# Altium schematic sheet S3220A1.SchDoc: Power supply and interfaces
size A3; Revision: A; SheetNumber: 1; SheetTotal: 5
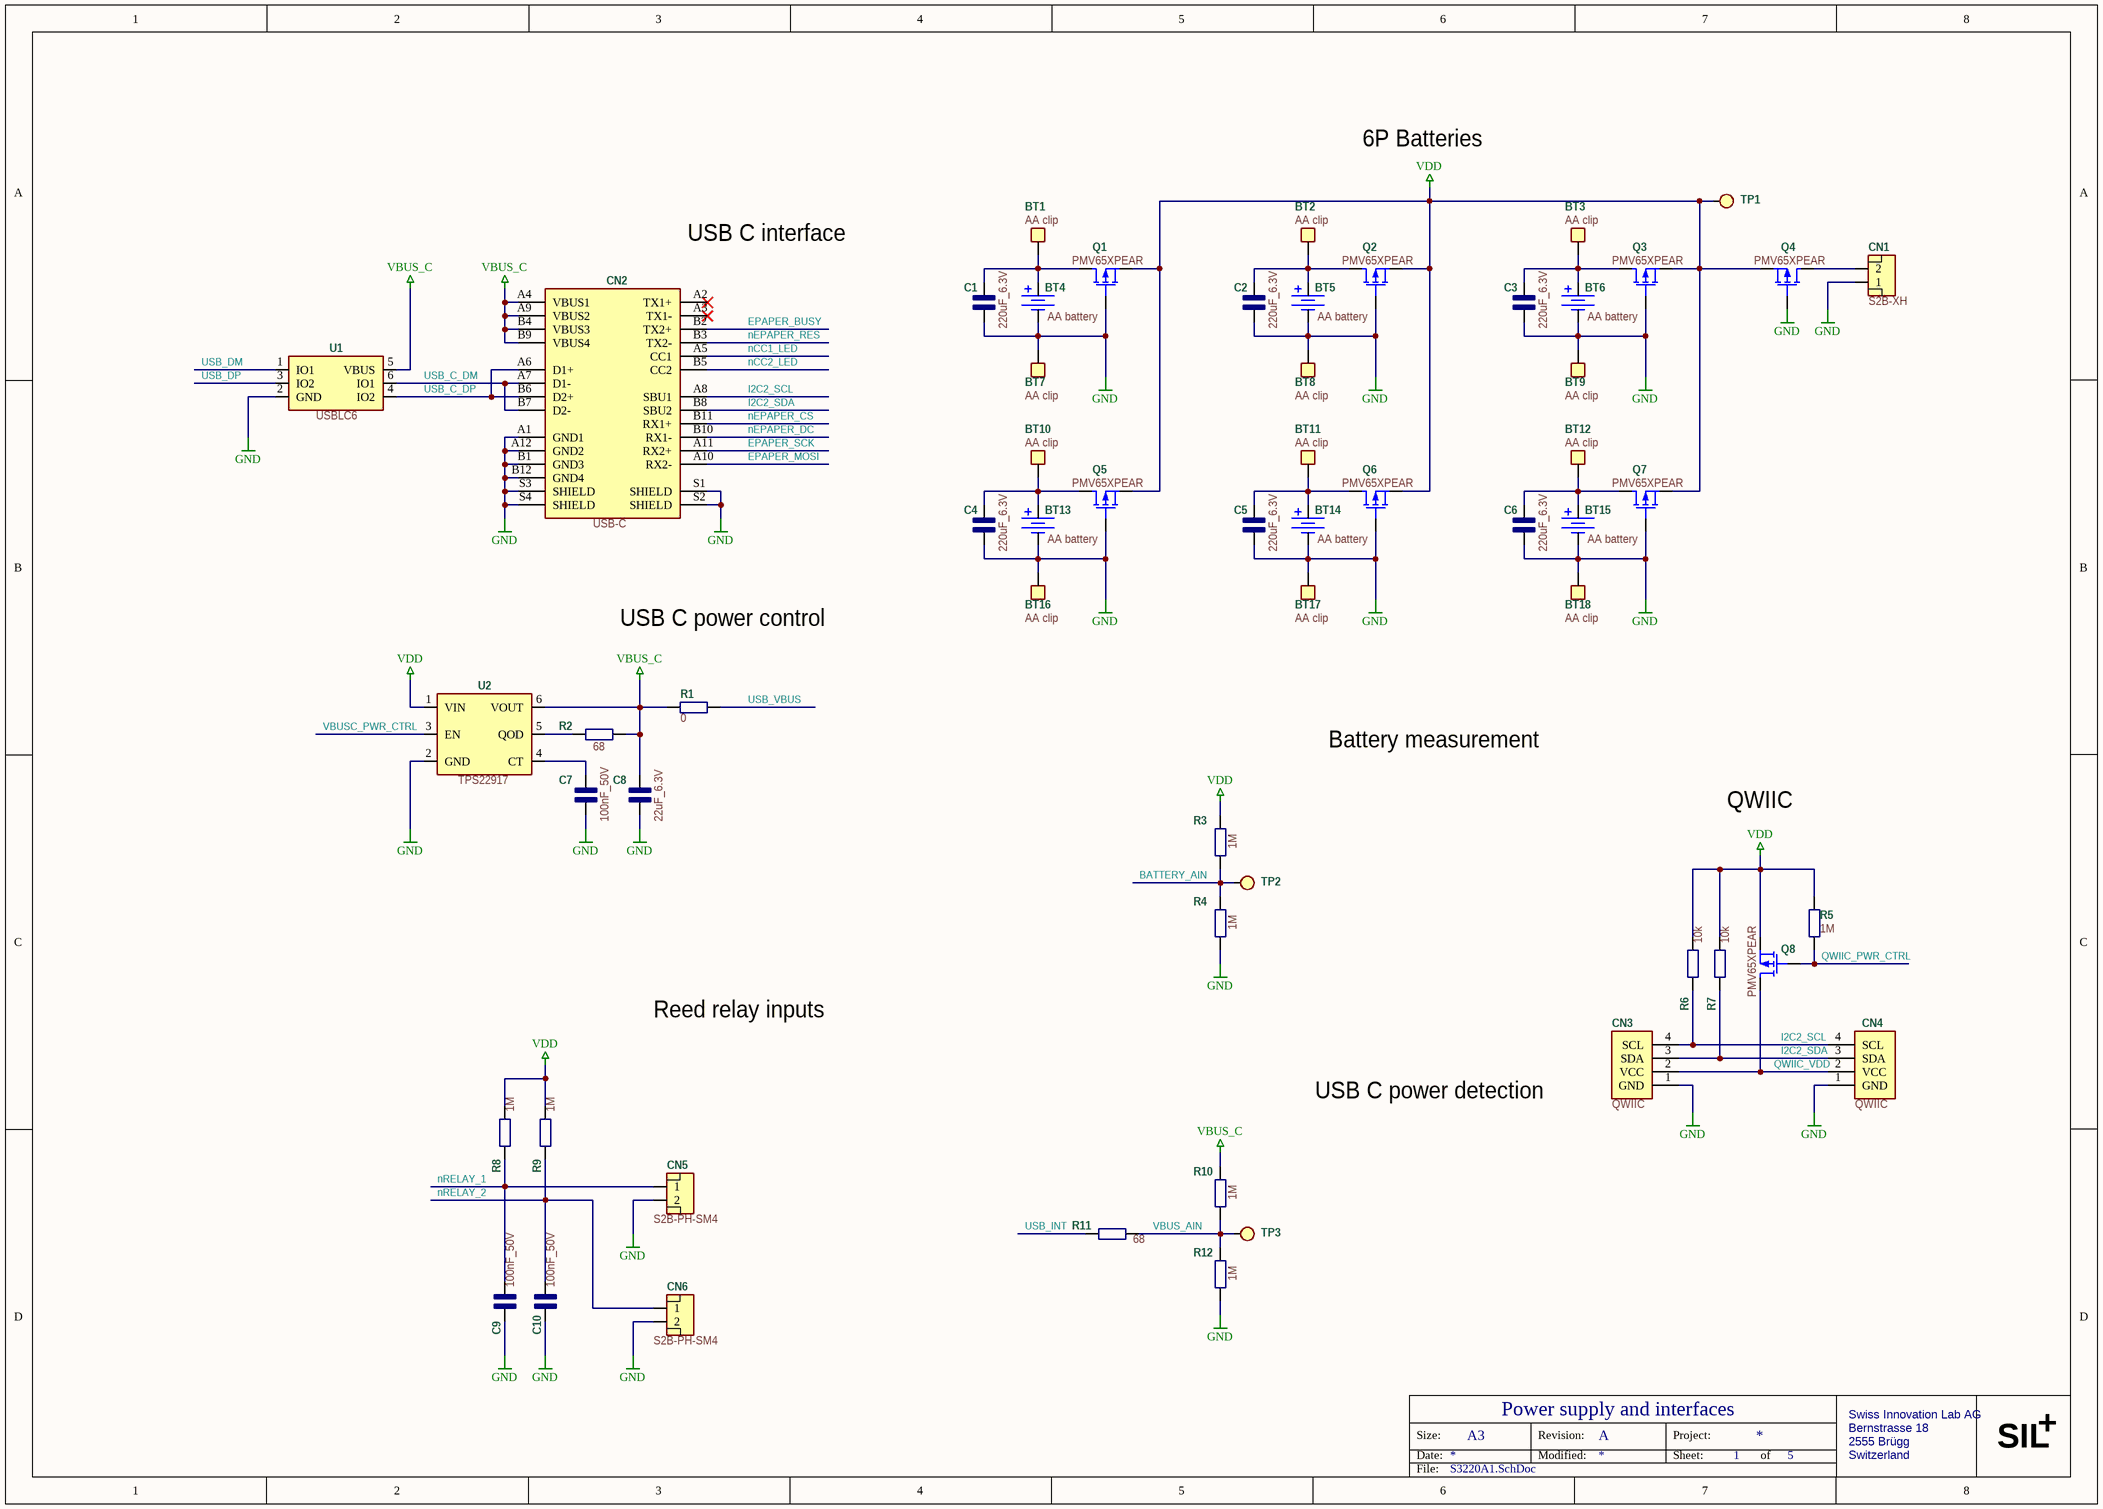
[diagram p0: S3220A1.SchDoc]

## Parts
BT1  AA clip  [BT_AA-TH-CLIP]  (no BOM)
BT2  AA clip  [BT_AA-TH-CLIP]  (no BOM)
BT3  AA clip  [BT_AA-TH-CLIP]  (no BOM)
BT4  AA battery  [BT_AA-battery]  (no BOM)
BT5  AA battery  [BT_AA-battery]  (no BOM)
BT6  AA battery  [BT_AA-battery]  (no BOM)
BT7  AA clip  [BT_AA-TH-CLIP]  (no BOM)
BT8  AA clip  [BT_AA-TH-CLIP]  (no BOM)
BT9  AA clip  [BT_AA-TH-CLIP]  (no BOM)
BT10  AA clip  [BT_AA-TH-CLIP]  (no BOM)
BT11  AA clip  [BT_AA-TH-CLIP]  (no BOM)
BT12  AA clip  [BT_AA-TH-CLIP]  (no BOM)
BT13  AA battery  [BT_AA-battery]  (no BOM)
BT14  AA battery  [BT_AA-battery]  (no BOM)
BT15  AA battery  [BT_AA-battery]  (no BOM)
BT16  AA clip  [BT_AA-TH-CLIP]  (no BOM)
BT17  AA clip  [BT_AA-TH-CLIP]  (no BOM)
BT18  AA clip  [BT_AA-TH-CLIP]  (no BOM)
C1  220uF_6.3V  [C_1206]
C2  220uF_6.3V  [C_1206]
C3  220uF_6.3V  [C_1206]
C4  220uF_6.3V  [C_1206]
C5  220uF_6.3V  [C_1206]
C6  220uF_6.3V  [C_1206]
C7  100nF_50V  [C_0603]
C8  22uF_6.3V  [C_0603]
C9  100nF_50V  [C_0603]
C10  100nF_50V  [C_0603]
CN1  S2B-XH  [CN_S2B-XH-A]
CN2  USB-C  [CN_USB-C-RA_2]
CN3  QWIIC  [CN_SM04B-SRSS-TB]
CN4  QWIIC  [CN_SM04B-SRSS-TB]
CN5  S2B-PH-SM4  [CN_S2B-PH-SM4]
CN6  S2B-PH-SM4  [CN_S2B-PH-SM4]
Q1  PMV65XPEAR  [U_SOT23-3]
Q2  PMV65XPEAR  [U_SOT23-3]
Q3  PMV65XPEAR  [U_SOT23-3]
Q4  PMV65XPEAR  [U_SOT23-3]
Q5  PMV65XPEAR  [U_SOT23-3]
Q6  PMV65XPEAR  [U_SOT23-3]
Q7  PMV65XPEAR  [U_SOT23-3]
Q8  PMV65XPEAR  [U_SOT23-3]
R1  0  [R_0603]
R2  68  [R_0603]
R3  1M  [R_0603]
R4  1M  [R_0603]
R5  1M  [R_0603]
R6  10k  [R_0603]
R7  10k  [R_0603]
R8  1M  [R_0603]
R9  1M  [R_0603]
R10  1M  [R_0603]
R11  68  [R_0603]
R12  1M  [R_0603]
TP1  Test point  [TP_SMD_R1.0mm]  (value not drawn)  (no BOM)
TP2  Test point  [TP_SMD_R1.0mm]  (value not drawn)  (no BOM)
TP3  Test point  [TP_SMD_R1.0mm]  (value not drawn)  (no BOM)
U1  USBLC6  [U_SOT23-6]
U2  TPS22917  [U_SOT23-6]

## Nets
GND: BT7.1 BT8.1 BT9.1 BT16.1 BT17.1 BT18.1 C1.1 C2.1 C3.1 C4.1 C5.1 C6.1 C7.1 C8.1 C9.1 C10.1 CN1.1 CN2.A1(GND1) CN2.A12(GND2) CN2.B1(GND3) CN2.B12(GND4) CN2.S1(SHIELD) CN2.S2(SHIELD) CN2.S3(SHIELD) CN2.S4(SHIELD) CN3.1(GND) CN4.1(GND) CN5.2 CN6.2 Q1.1(G) Q2.1(G) Q3.1(G) Q4.1(G) Q5.1(G) Q6.1(G) Q7.1(G) R4.1 R12.1 U1.2(GND) U2.2(GND)
VBUS_C: C8.2 CN2.A4(VBUS1) CN2.A9(VBUS2) CN2.B4(VBUS3) CN2.B9(VBUS4) R1.1 R2.1 R10.2 U1.5(VBUS) U2.6(VOUT)
VDD: Q1.2(S) Q2.2(S) Q3.2(S) Q4.2(S) Q5.2(S) Q6.2(S) Q7.2(S) Q8.2(S) R3.2 R5.2 R6.2 R7.2 R8.2 R9.2 TP1.1 U2.1(VIN)
BATTERY_AIN: R3.1 R4.2 TP2.1
EPAPER_BUSY: CN2.B2(TX2+)
EPAPER_MOSI: CN2.A10(RX2-)
EPAPER_SCK: CN2.A11(RX2+)
I2C2_SCL: CN2.A8(SBU1) CN3.4(SCL) CN4.4(SCL) R6.1
I2C2_SDA: CN2.B8(SBU2) CN3.3(SDA) CN4.3(SDA) R7.1
nCC1_LED: CN2.A5(CC1)
nCC2_LED: CN2.B5(CC2)
nEPAPER_CS: CN2.B11(RX1+)
nEPAPER_DC: CN2.B10(RX1-)
nEPAPER_RES: CN2.B3(TX2-)
nRELAY_1: C9.2 CN5.1 R8.1
nRELAY_2: C10.2 CN6.1 R9.1
QWIIC_PWR_CTRL: Q8.1(G) R5.1
QWIIC_VDD: CN3.2(VCC) CN4.2(VCC) Q8.3(D)
USB_C_DM: CN2.A7(D1-) CN2.B7(D2-) U1.6(IO1)
USB_C_DP: CN2.A6(D1+) CN2.B6(D2+) U1.4(IO2)
USB_DM: U1.1(IO1)
USB_DP: U1.3(IO2)
USB_INT: R11.1
USB_VBUS: R1.2
VBUS_AIN: R10.1 R11.2 R12.2 TP3.1
VBUSC_PWR_CTRL: U2.3(EN)
NetBT1_1: BT1.1 C1.2 Q1.3(D)
NetBT2_1: BT2.1 C2.2 Q2.3(D)
NetBT3_1: BT3.1 C3.2 Q3.3(D)
NetBT10_1: BT10.1 C4.2 Q5.3(D)
NetBT11_1: BT11.1 C5.2 Q6.3(D)
NetBT12_1: BT12.1 C6.2 Q7.3(D)
NetC7_2: C7.2 U2.4(CT)
NetCN1_2: CN1.2 Q4.3(D)
NetR2_2: R2.2 U2.5(QOD)

Not connected (* = marked no-connect by the designer): CN2 A2(TX1+)* A3(TX1-)*

## Notes on the sheet
- 6P Batteries
- USB C interface
- USB C power control
- Battery measurement
- QWIIC
- Reed relay inputs
- USB C power detection
- Size:
- Date:
- A3
- Revision:
- Modified:
- Project:
- Sheet:
- of
- Swiss Innovation Lab AG
- Bernstrasse 18
- 2555 Brügg
- Switzerland
- SIL
- +
- File:

## Library data of the parts
BT1-BT3 BT7-BT12 BT16-BT18 = BT_AA-TH-CLIP: Battery Contact Clip A, AA 1 Cell PC Pin; Manufacturer: Keystone Electronics; Manufacturer Part Number: 92; Currency: $; Value: AA clip; Price: 0,20178; Supplier 1: Digi-Key; Supplier Part Number 1: 36-92-ND
BT4-BT6 BT13-BT15 = BT_AA-battery: Manufacturer: SIL; Currency: $; Value: AA battery; Supplier 1: SIL
C1-C6 = C_220uF_6.3V: 220µF ±20% 6.3V Ceramic Capacitor X5R 1206 (3216 Metric); Manufacturer: Murata Electronics North America; Manufacturer Part Number: GRM31CR60J227ME11L; Value: 220uF; ValueAux: _6.3V; Currency: $; Price: 0,59945; Supplier 1: Digi-Key; Supplier Part Number 1: 490-13970-1-ND
C7 C9 C10 = C_100nF_50V: 0.1µF ±10% 50V Ceramic Capacitor X7R 0603 (1608 Metric); Manufacturer: TDK; Manufacturer Part Number: C1608X7R1H104K080AA; Value: 100nF; ValueAux: _50V; Currency: $; Price: 0,01309; Supplier 1: Digi-Key; Supplier Part Number 1: 445-1314-6-ND
C8 = C_22uF_6V3: 22µF ±20% 6.3V Ceramic Capacitor X5R 0603 (1608 Metric); Manufacturer: Samsung Electro-Mechanics; Manufacturer Part Number: CL10A226MQ8NRNC; Value: 22uF; ValueAux: _6.3V; Currency: $; Price: 0,04566; Supplier 1: Digi-Key; Supplier Part Number 1: 1276-1193-1-ND
CN1 = CN_S2B-XH: Connector Header Through Hole, Right Angle 2 position 0.098" (2.50mm); Manufacturer: JST Sales America Inc.; Manufacturer Part Number: S2B-XH-A(LF)(SN); Currency: $; Supplier 1: Digi-Key; Supplier Part Number 1: 455-2257-ND; Value: S2B-XH; Price: 0,07792
CN2 = CN_USB-C-RA_2: USB-C (USB TYPE-C) USB 3.2 Gen 2 (USB 3.1 Gen 2, Superspeed + (USB 3.1)) Receptacle Connector 24 Position Surface Mount, Right Angle; Through Hole; Manufacturer: CUI Devices; Manufacturer Part Number: UJ31-CH-G-SMT-TR-67; Currency: $; Value: USB-C; Price: 2,43252; Supplier 1: Digi-Key; Supplier Part Number 1: 2223-UJ31-CH-G-SMT-TR-67CT-ND
CN3 CN4 = CN_QWICC: Connector Header Surface Mount, Right Angle 4 position 0.039" (1.00mm); Manufacturer: JST Sales America Inc.; Manufacturer Part Number: SM04B-SRSS-TB(LF)(SN); Currency: $; Supplier 1: Digi-Key; Supplier Part Number 1: 455-1804-1-ND; Value: QWIIC; Price: 0,61
CN5 CN6 = CN_S2B-PH-SM4: Connector Header Surface Mount, Right Angle 2 position 0.079" (2.00mm); Manufacturer: JST Sales America Inc.; Manufacturer Part Number: S2B-PH-SM4-TB(LF)(SN); Currency: $; Supplier 1: Digi-Key; Supplier Part Number 1: 455-1749-1-ND; Value: S2B-PH-SM4; Price: 0,36470
Q1-Q8 = Q_PMV65: P-Channel 20V 2.8A (Ta) 480mW (Ta), 6.25W (Tc) Surface Mount TO-236AB (SOT23); Manufacturer: Nexperia USA Inc.; Currency: $; Value: PMV65XPEAR; Manufacturer Part Number: PMV65XPEAR; Price: 0,11204; Supplier 1: Digi-Key; Supplier Part Number 1: 1727-2310-1-ND
R1 = R_0_1%: 0 Ohms Jumper 0.1W, 1/10W Chip Resistor 0603 (1608 Metric) Automotive AEC-Q200 Thick Film; Manufacturer: Panasonic Electronic Components; Manufacturer Part Number: ERJ-3GEY0R00V; Currency: $; Value: 0; Price: 0,00962; Supplier 1: Digi-Key; Supplier Part Number 1: P0.0GCT-ND
R2 R11 = R_68_1%: 68 Ohms ±1% 0.1W, 1/10W Chip Resistor 0603 (1608 Metric) Automotive AEC-Q200 Thick Film; Manufacturer: Panasonic Electronic Components; Manufacturer Part Number: ERJ-3EKF68R0V; Currency: $; Value: 68; Price: 0,01449; Supplier 1: Digi-Key; Supplier Part Number 1: P68.0HCT-ND
R3-R5 R8-R10 R12 = R_1M_1%: 1 MOhms ±1% 0.1W, 1/10W Chip Resistor 0603 (1608 Metric) Automotive AEC-Q200 Thick Film; Manufacturer: Panasonic Electronic Components; Manufacturer Part Number: ERJ-3EKF1004V; Currency: $; Value: 1M; Price: 0,01264; Supplier 1: Digi-Key; Supplier Part Number 1: P1.00MHCT-ND
R6 R7 = R_10k_1%: 10 kOhms ±1% 0.1W, 1/10W Chip Resistor 0603 (1608 Metric) Automotive AEC-Q200 Thick Film; Manufacturer: Panasonic Electronic Components; Manufacturer Part Number: ERJ-3EKF1002V; Currency: $; Value: 10k; Price: 0,01449; Supplier 1: Digi-Key; Supplier Part Number 1: P10.0KHCT-ND
TP1-TP3 = TP_Test_point: Manufacturer: Swiss Innovation Lab; Currency: $; Value: Test point; Manufacturer Part Number: Test point; Price: 0
U1 = U_USBLC6: TVS DIODE 5.25V 17V SOT23-6; Manufacturer: STMicroelectronics; Manufacturer Part Number: USBLC6-2SC6Y; Currency: $; Value: USBLC6; Price: 0,33501; Supplier 1: Digi-Key; Supplier Part Number 1: 497-11882-6-ND
U2 = U_TPS22917: Power Switch/Driver 1:1 P-Channel 2A SOT-23-6; Manufacturer: Texas Instruments; Manufacturer Part Number: TPS22917DBVR; Currency: $; Value: TPS22917; Price: 0,19065; Supplier 1: Digi-Key; Supplier Part Number 1: 296-50498-1-ND